# Altium schematic sheet Sensor Bar 2.0 by GAO.SchDoc
size A4
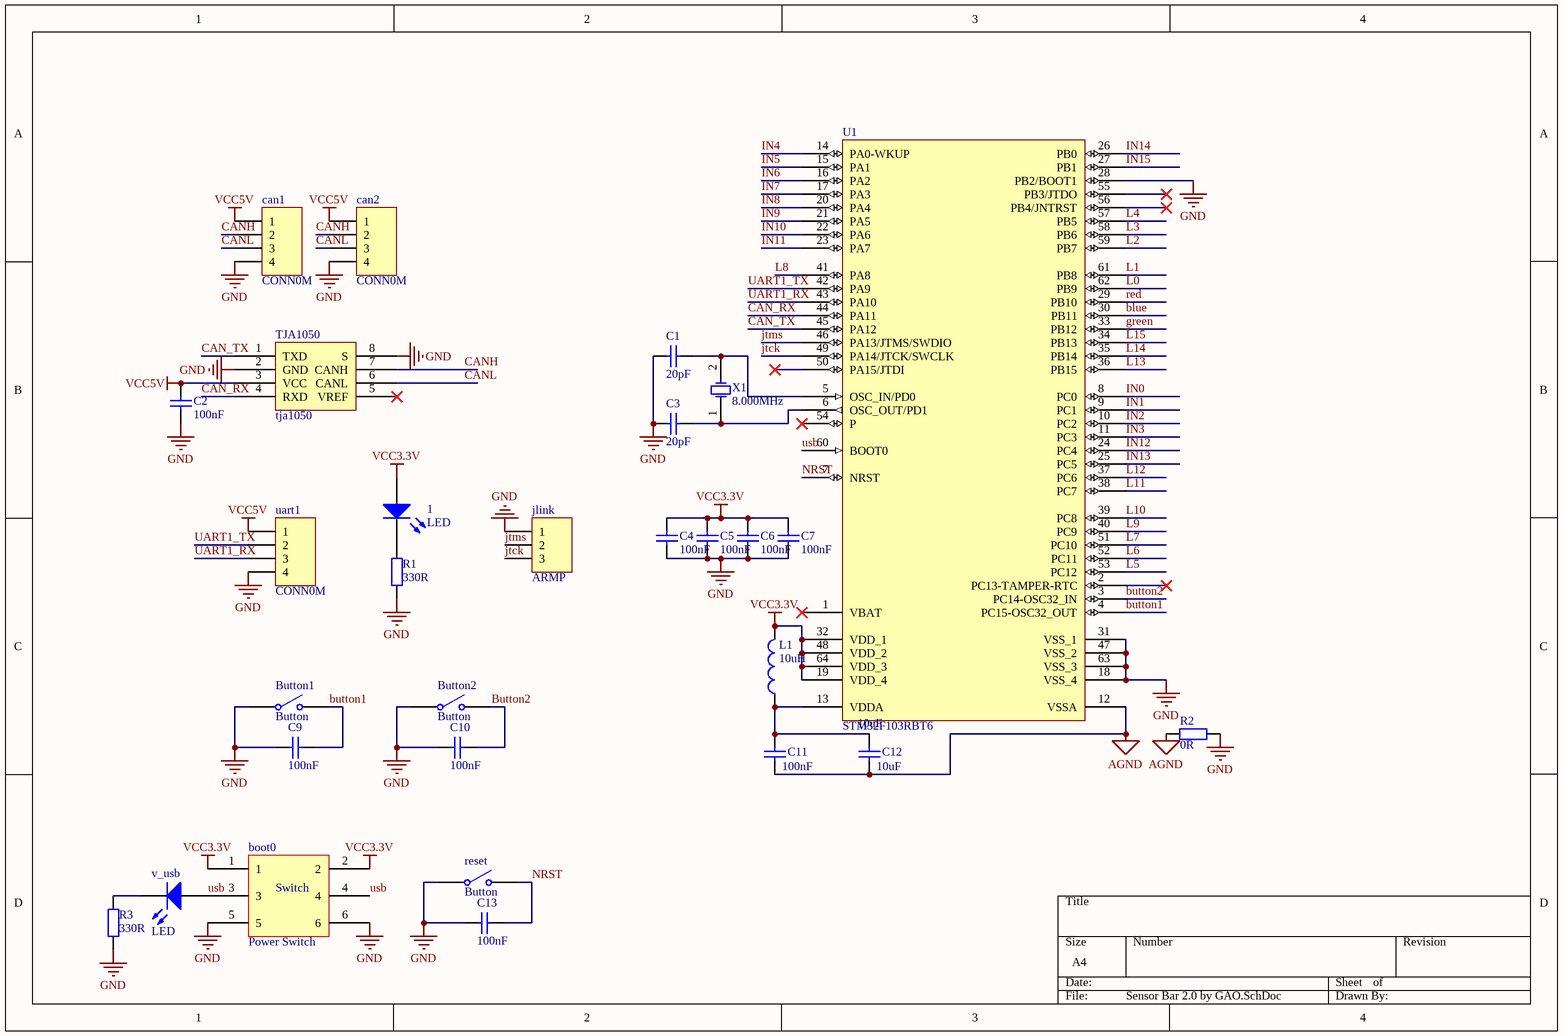
[diagram p0: Sensor Bar 2.0 by GAO.SchDoc]

## Parts
1  LED  [SMD _LED]
boot0  Power Switch  [POWER SWITCH]
Button1  Button  [PUSH SWITCH]
Button2  Button  [PUSH SWITCH]
C1  20pF  [CC2012-0805]
C2  100nF  [CC2012-0805]
C3  20pF  [CC2012-0805]
C4  100nF  [CC2012-0805]
C5  100nF  [CC2012-0805]
C6  100nF  [CC2012-0805]
C7  100nF  [CC2012-0805]
C9  100nF  [CC2012-0805]
C10  100nF  [CC2012-0805]
C11  100nF  [CC2012-0805]
C12  10uF  [CC3216-1206]
C13  100nF  [CC2012-0805]
can1  CONN0M  [LOCKEDHDR-4]
can2  CONN0M  [LOCKEDHDR-4]
jlink  ARMP  [LOCKEDHDR-3]
L1  10uH  [CR3225-1210]
R1  330R  [CR2012-0805]
R2  value 0R  [CR2012-0805]  (hidden comment: oR)
R3  330R  [CR2012-0805]
reset  Button  [PUSH SWITCH]
TJA1050  tja1050  [ad8210]
U1  STM32F103RBT6  [LQFP64_N]
uart1  CONN0M  [LOCKEDHDR-4]
v_usb  LED  [SMD _LED]
X1  8.000MHz  [BCY-W2/E4.7]

## Nets
AGND: C11.1 C12.1 R2.2 U1.12(VSSA)
GND: boot0.5 boot0.6 Button1.1(COMMON) Button2.1(COMMON) C1.2 C2.1 C3.2 C4.1 C5.1 C6.1 C7.1 C9.2 C10.2 C13.2 can1.4 can2.4 jlink.1 R1.1 R2.1 R3.1 reset.1(COMMON) TJA1050.2(GND) TJA1050.8(S) U1.18(VSS_4) U1.28(PB2/BOOT1) U1.31(VSS_1) U1.47(VSS_2) U1.63(VSS_3) uart1.4
VCC3.3V: 1.1(A) boot0.1 boot0.2 C4.2 C5.2 C6.2 C7.2 L1.2 U1.19(VDD_4) U1.32(VDD_1) U1.48(VDD_2) U1.64(VDD_3)
VCC5V: C2.2 can1.1 can2.1 TJA1050.3(VCC) uart1.1
blue: U1.30(PB11)
button1: Button1.2(NO) C9.1 U1.4(PC15-OSC32_OUT)
Button2: Button2.2(NO) C10.1 U1.3(PC14-OSC32_IN)
CAN_RX: TJA1050.4(RXD) U1.44(PA11)
CAN_TX: TJA1050.1(TXD) U1.45(PA12)
CANH: can1.2 can2.2 TJA1050.7(CANH)
CANL: can1.3 can2.3 TJA1050.6(CANL)
green: U1.33(PB12)
IN0: U1.8(PC0)
IN1: U1.9(PC1)
IN2: U1.10(PC2)
IN3: U1.11(PC3)
IN4: U1.14(PA0-WKUP)
IN5: U1.15(PA1)
IN6: U1.16(PA2)
IN7: U1.17(PA3)
IN8: U1.20(PA4)
IN9: U1.21(PA5)
IN10: U1.22(PA6)
IN11: U1.23(PA7)
IN12: U1.24(PC4)
IN13: U1.25(PC5)
IN14: U1.26(PB0)
IN15: U1.27(PB1)
jtck: jlink.3 U1.49(PA14/JTCK/SWCLK)
jtms: jlink.2 U1.46(PA13/JTMS/SWDIO)
L0: U1.62(PB9)
L1: U1.61(PB8)
L2: U1.59(PB7)
L3: U1.58(PB6)
L4: U1.57(PB5)
L5: U1.53(PC12)
L6: U1.52(PC11)
L7: U1.51(PC10)
L8: U1.41(PA8)
L9: U1.40(PC9)
L10: U1.39(PC8)
L11: U1.38(PC7)
L12: U1.37(PC6)
L13: U1.36(PB15)
L14: U1.35(PB14)
L15: U1.34(PB13)
NRST: C13.1 reset.2(NO) U1.7(NRST)
red: U1.29(PB10)
UART1_RX: U1.43(PA10) uart1.3
UART1_TX: U1.42(PA9) uart1.2
usb: boot0.3 boot0.4 U1.60(BOOT0) v_usb.1(A)
Net1_2: 1.2(K) R1.2
NetC1_1: C1.1 U1.5(OSC_IN/PD0) X1.2(OSC2)
NetC3_1: C3.1 U1.6(OSC_OUT/PD1) X1.1(OSC1)
NetC11_2: C11.2 C12.2 L1.1 U1.13(VDDA)
NetR3_2: R3.2 v_usb.2(K)

Not connected (* = marked no-connect by the designer): TJA1050 5(VREF)*; U1 1(VBAT)* 2(PC13-TAMPER-RTC)* 50(PA15/JTDI)* 54(P)* 55(PB3/JTDO)* 56(PB4/JNTRST)*

## Notes on the sheet
- (in symbol Power Switch) Switch

## Library data of the parts
1 v_usb = LED1: Typical RED GaAs LED; Published: 8-Jun-2000; LatestRevisionDate: 08-Jul-2005; LatestRevisionNote: Mech Layer 1 removed.; PackageReference: LED-1; Publisher: Altium Limited
Button1 Button2 reset = SW-SPST: Single-Pole, Single-Throw Switch; Published: 24-Mar-1999; Revision: July-2002: Re-released for DXP Platform.; Publisher: Altium Limited
C1-C7 C9-C13 = Cap Semi: Capacitor (Semiconductor SIM Model); Published: 8-Jun-2000; LatestRevisionDate: 17-Jul-2002; LatestRevisionNote: Re-released for DXP Platform.; PackageReference: C1206; Publisher: Altium Limited
  C11: value: 100nF
  C12: value: 10uF
can1 can2 uart1 = Header 4: Header, 4-Pin; Revision: 17-Jul-2002: Re-released for DXP Platform.; Publisher: Altium Limited
jlink = Header 3: Header, 3-Pin; Revision: 17-Jul-2002: Re-released for DXP Platform.; Publisher: Altium Limited
L1 = Inductor: Published: 8-Jun-2000; Revision: July-2002: Re-released for DXP Platform.; Publisher: Altium Limited; Value: 10uH
R1-R3 = Res2: Resistor; Published: 8-Jun-2000; Revision: July-2002: Re-released for DXP Platform.; Publisher: Altium Limited
  R3: Value: 330R
U1 = STM32F103RBT6: STM32 ARM-based 32-bit MCU with 128 Kbytes Flash, 64-pin LQFP, Industrial Temperature; Published: 30-May-2008; DatasheetVersion: rev6, Mar-2008; PackageVersion: Mar-2008; PackageReference: LQFP64; Publisher: Altium Limited; PackageDescription: 64-Pin Low-Profile Quad Flat Pack, 10 x 10 mm Body, 0.5 mm Pitch (LQFP64); ComponentLink1Description: Manufacturer Link; ComponentLink1URL: www.st.com/stm32; ComponentLink2Description: Datasheet; ComponentLink2URL: http://www.st.com/stonline/products/literature/ds/13587.pdf
X1 = XTAL: Crystal Oscillator; Published: 8-Jun-2000; Revision: July-2002: Re-released for DXP Platform.; Publisher: Altium Limited